# Altium schematic sheet 0_1_RevHis.SchDoc: Revision History
size A3; SheetNumber: 0.1
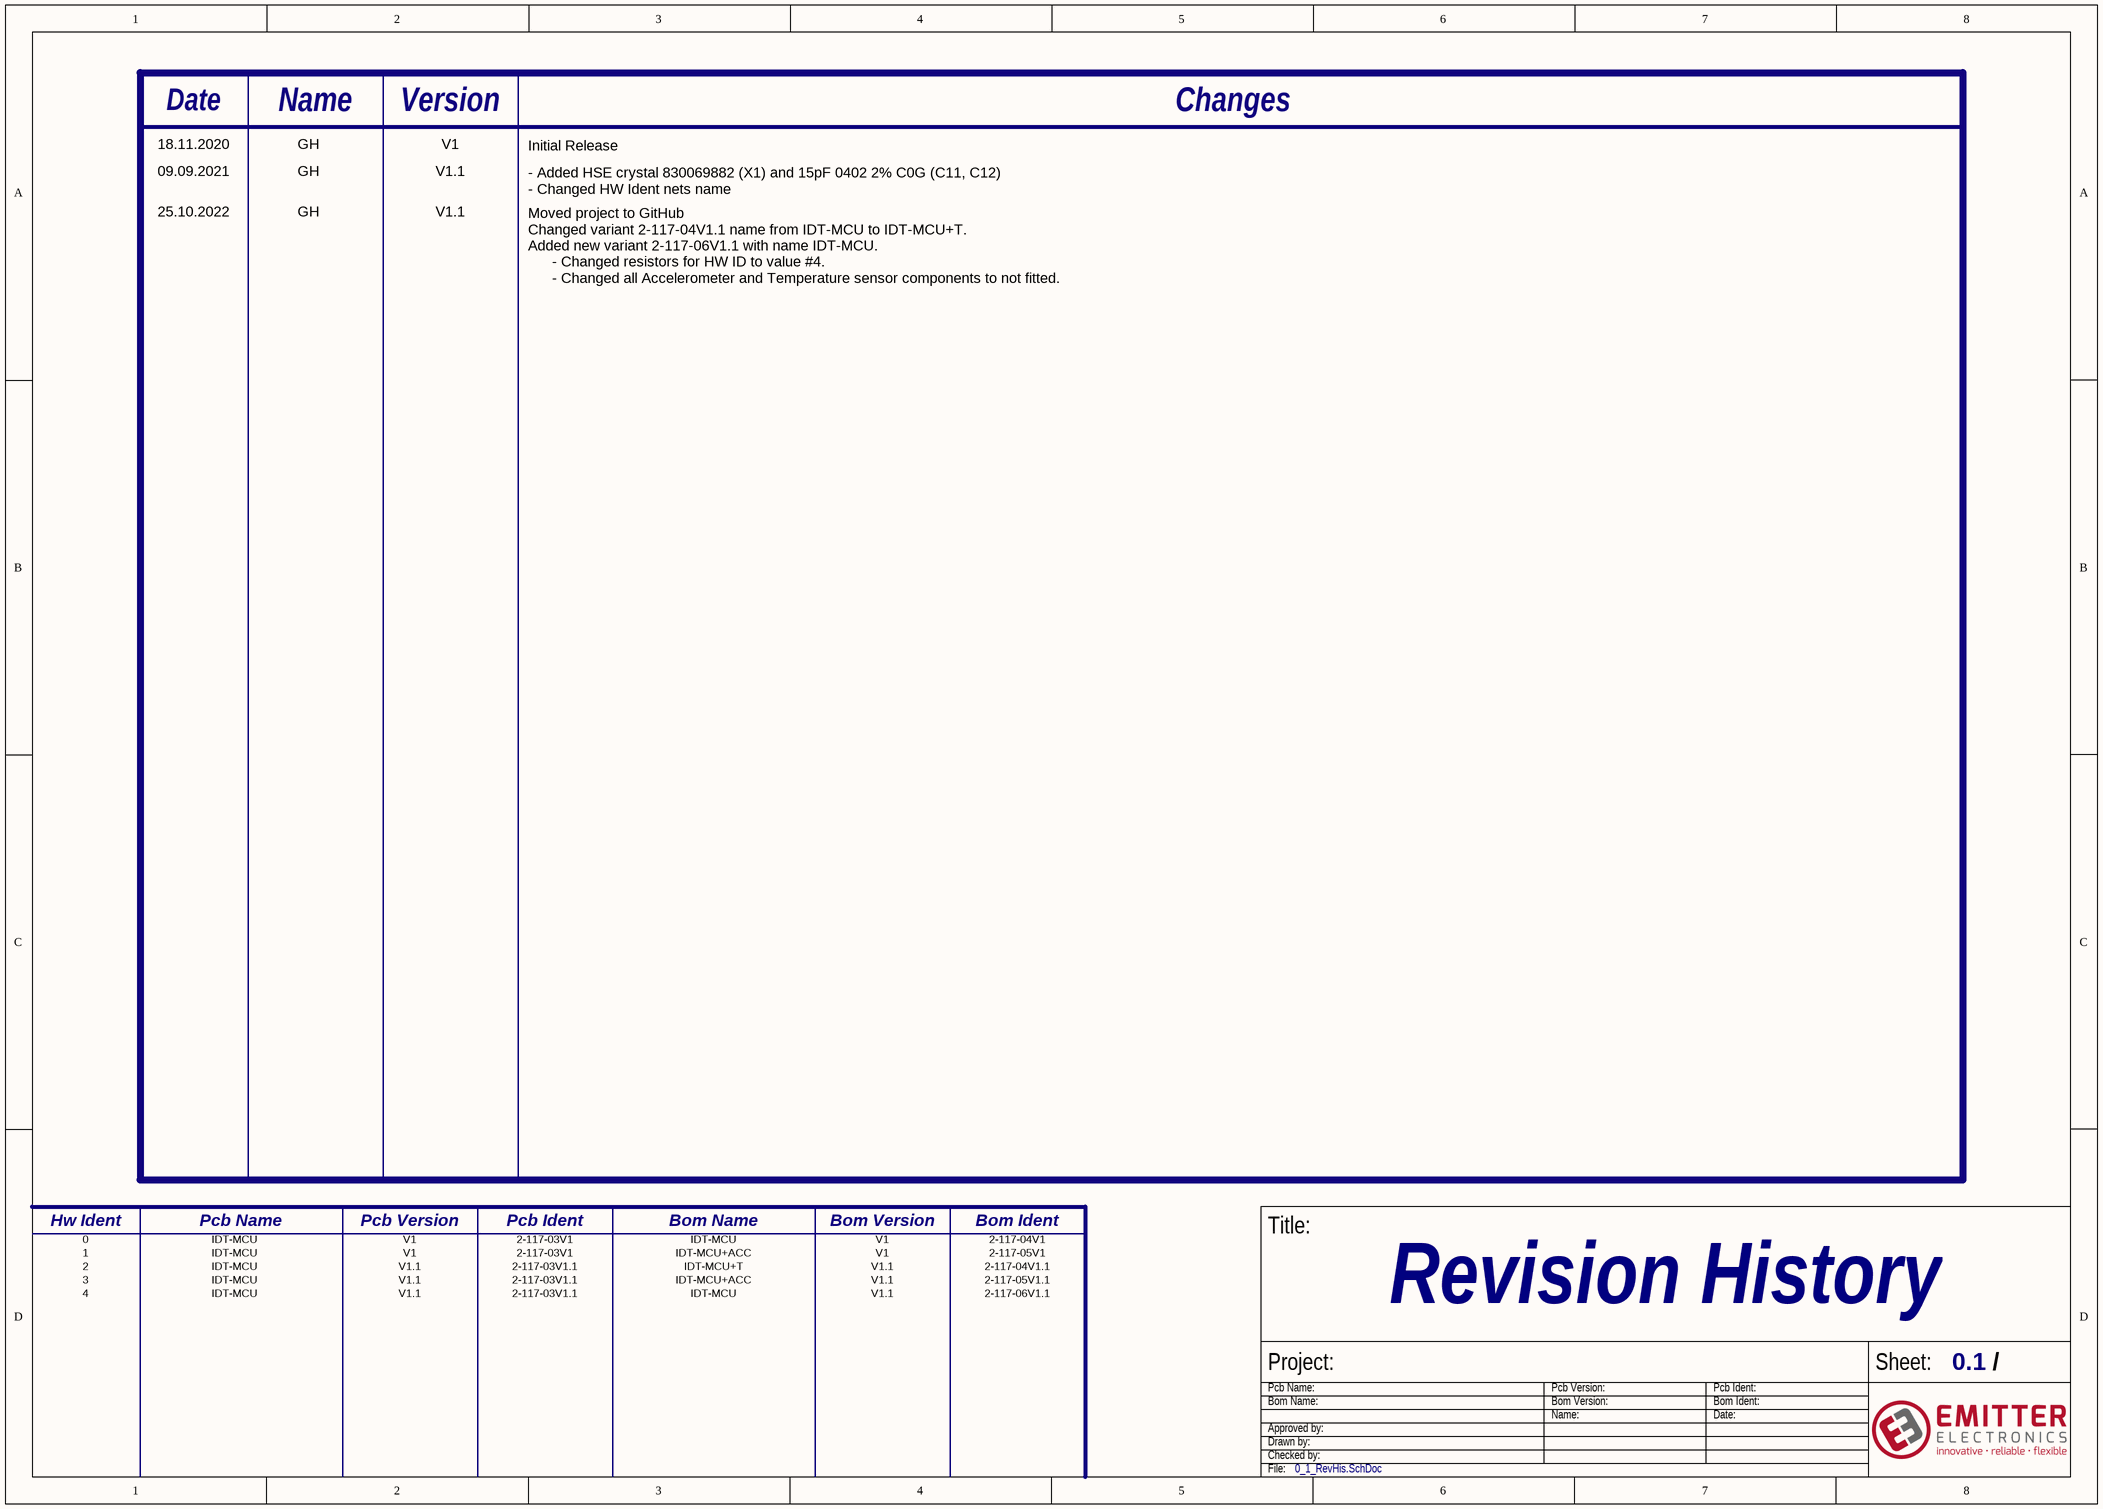
[diagram p0: 0_1_RevHis.SchDoc]

## Notes on the sheet
- Date
- Name
- Version
- Changes
- 18.11.2020
- 09.09.2021
- GH
- V1
- V1.1
- Initial Release
- 25.10.2022
- - Added HSE crystal 830069882 (X1) and 15pF 0402 2% C0G (C11, C12)
  - Changed HW Ident nets name
- Moved project to GitHub
  Changed variant 2-117-04V1.1 name from IDT-MCU to IDT-MCU+T.
  Added new variant 2-117-06V1.1 with name IDT-MCU.
  - Changed resistors for HW ID to value #4.
  - Changed all Accelerometer and Temperature sensor components to not fitted.
- Hw Ident
- 0
- 1
- IDT-MCU
- Pcb Name
- Pcb Version
- Pcb Ident
- 2-117-03V1
- Bom Name
- IDT-MCU+ACC
- Bom Version
- Bom Ident
- 2-117-04V1
- 2-117-05V1
- 2
- 3
- 4
- 2-117-03V1.1
- IDT-MCU+T
- 2-117-04V1.1
- 2-117-05V1.1
- 2-117-06V1.1
- Title:
- Project:
- Pcb Name:
- Pcb Version:
- Pcb Ident:
- Sheet:
- /
- Bom Name:
- Drawn by:
- Checked by:
- Approved by:
- Bom Version:
- Name:
- Bom Ident:
- Date:
- File: